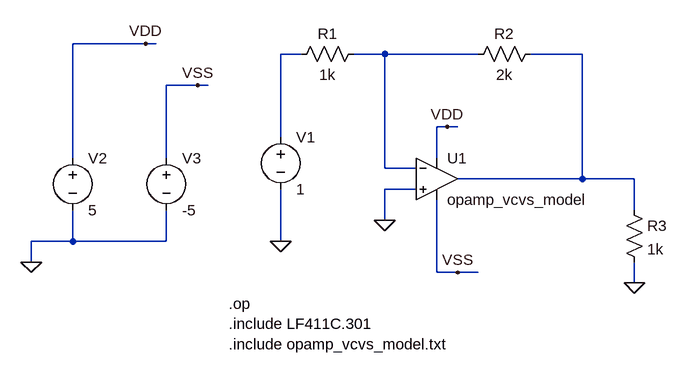
[diagram p0: schematic Draft9.asc]
Draft9.asc, the LTspice schematic file:
Version 4
SHEET 1 884 680
WIRE 80 80 -32 80
WIRE 96 80 80 80
WIRE 320 96 288 96
WIRE 448 96 400 96
WIRE 592 96 448 96
WIRE 752 96 672 96
WIRE 160 144 112 144
WIRE 176 144 160 144
WIRE 544 208 528 208
WIRE 560 208 544 208
WIRE 288 224 288 96
WIRE -32 256 -32 80
WIRE 112 256 112 144
WIRE 528 256 528 208
WIRE 448 272 448 96
WIRE 496 272 448 272
WIRE 752 288 752 96
WIRE 752 288 560 288
WIRE 832 288 752 288
WIRE 496 304 448 304
WIRE 832 336 832 288
WIRE 448 352 448 304
WIRE -32 384 -32 336
WIRE -32 384 -96 384
WIRE 112 384 112 336
WIRE 112 384 -32 384
WIRE 288 384 288 304
WIRE -96 416 -96 384
WIRE 528 432 528 320
WIRE 560 432 528 432
WIRE 592 432 560 432
WIRE 832 448 832 416
FLAG 448 352 0
FLAG 832 448 0
FLAG -96 416 0
FLAG 544 208 VDD
FLAG 560 432 VSS
FLAG 288 384 0
FLAG 80 80 VDD
FLAG 160 144 VSS
DATAFLAG 704 96 "$"
SYMBOL OpAmps/opamp2 528 224 R0
SYMATTR InstName U1
SYMATTR Value opamp_vcvs_model
SYMBOL res 688 80 R90
WINDOW 0 0 56 VBottom 2
WINDOW 3 32 56 VTop 2
SYMATTR InstName R2
SYMATTR Value 2k
SYMBOL res 816 320 R0
SYMATTR InstName R3
SYMATTR Value 1k
SYMBOL voltage -32 240 R0
SYMATTR InstName V2
SYMATTR Value 5
SYMBOL voltage 112 240 R0
SYMATTR InstName V3
SYMATTR Value -5
SYMBOL Res 416 80 R90
WINDOW 0 0 56 VBottom 2
WINDOW 3 32 56 VTop 2
SYMATTR InstName R1
SYMATTR Value 1k
SYMBOL voltage 288 208 R0
SYMATTR InstName V1
SYMATTR Value 1
TEXT 208 480 Left 2 !.op\n.include LF411C.301\n.include opamp_vcvs_model.txt

The netlist it stands for:
* Draft9.asc
XU1 0 N002 VDD VSS N003 opamp_vcvs_model  ; pins In+ In- V+ V- OUT
R2 N003 N002 2k
R3 N003 0 1k
V2 VDD 0 5
V3 VSS 0 -5
R1 N002 N001 1k
V1 N001 0 1
.op
.include LF411C.301
.include opamp_vcvs_model.txt
.backanno
.end